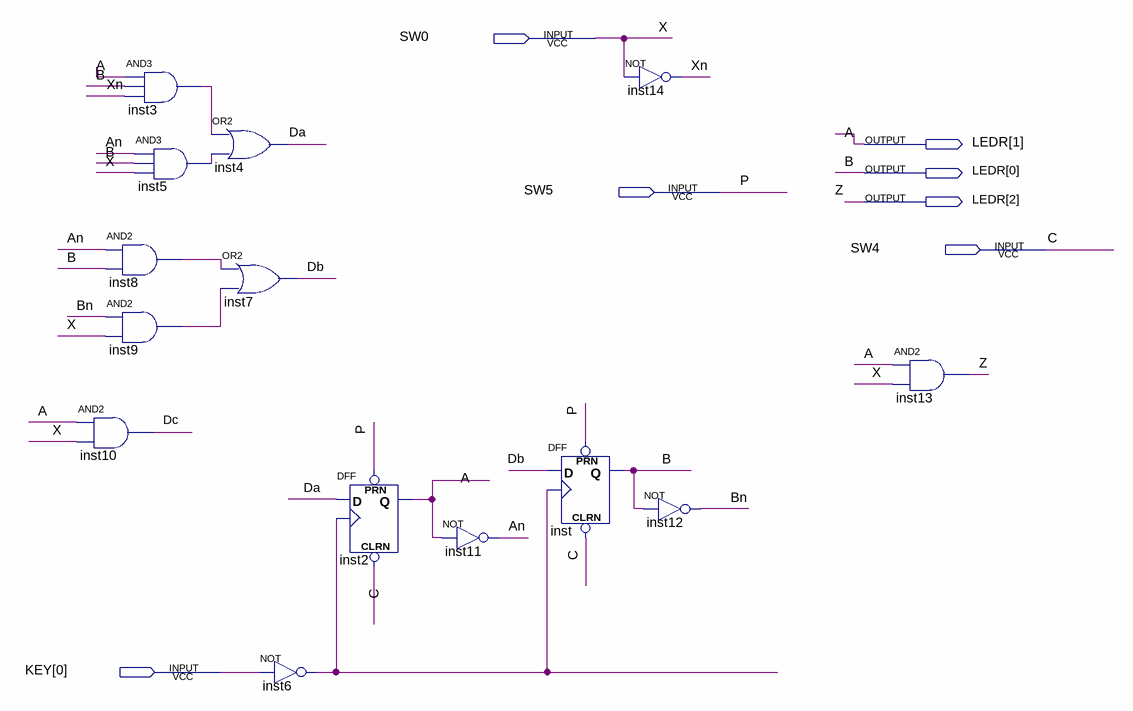
[diagram p0: schematic sheet]
// Quartus schematic Lab4P3.bdf as structural Verilog: 14 symbols, 7 pins
module Lab4P3 (
  input  SW0,
  input  SW5,
  input  SW4,
  input  [0:0] KEY,
  output [2:0] LEDR
);

  wire An, Bn, Da, Db, Dc, inst3_out, inst5_out, inst6_out, inst8_out, inst9_out, Xn;

  and inst10 (Dc, LEDR[1], SW0);
  and inst3 (inst3_out, LEDR[1], LEDR[0], Xn);
  and inst5 (inst5_out, An, LEDR[0], SW0);
  and inst8 (inst8_out, An, LEDR[0]);
  and inst9 (inst9_out, Bn, SW0);
  or inst4 (Da, inst3_out, inst5_out);
  or inst7 (Db, inst8_out, inst9_out);
  not inst6 (inst6_out, KEY[0]);
  DFF inst2 (.CLRN(SW4), .CLK(inst6_out), .D(Da), .PRN(SW5), .Q(LEDR[1]));
  not inst11 (An, LEDR[1]);
  DFF inst (.CLRN(SW4), .CLK(inst6_out), .D(Db), .PRN(SW5), .Q(LEDR[0]));
  not inst14 (Xn, SW0);
  not inst12 (Bn, LEDR[0]);
  and inst13 (LEDR[2], LEDR[1], SW0);

  // Other names for the same wires on the sheet: B = LEDR[0]; C = SW4; A = LEDR[1]; P = SW5; X = SW0; Z = LEDR[2]
endmodule
